# EAGLE design KS0108_MCP23x17 (EAGLE 7.6.0)
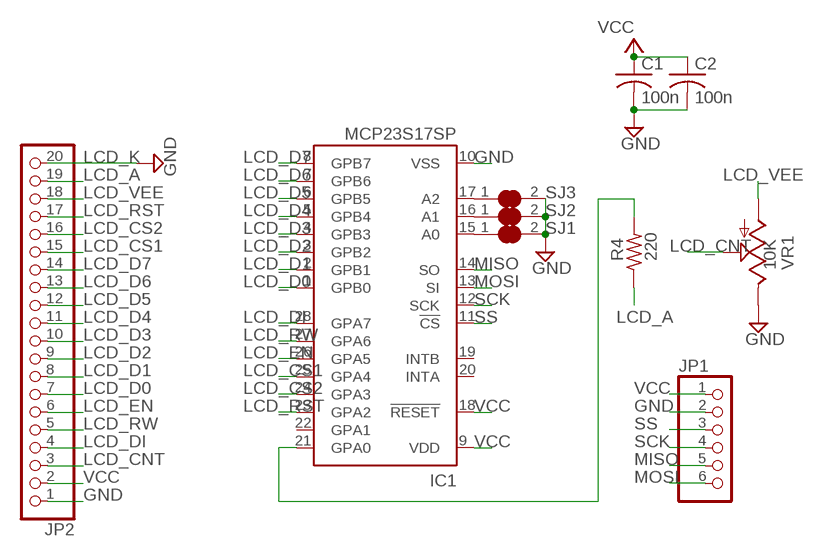
[diagram p0: schematic, sheet 1]

## Parts
C1  100n  C-USC0805K  [C0805K]
C2  100n  C-USC0805K  [C0805K]
IC1  MCP23S17SP  [DIL28-3]
JP1  PINHD-1X6CB  [1X06-CLEANBIG]
JP2  PINHD-1X20-BIG  [1X20-BIG]
R4  220  R-US_R0805  [R0805]
SJ1  SOLDERJUMPER_CLOSED  [SOLDERJUMPER_CLOSEDWIRE]
SJ2  SOLDERJUMPER_CLOSED  [SOLDERJUMPER_CLOSEDWIRE]
SJ3  SOLDERJUMPER_CLOSED  [SOLDERJUMPER_CLOSEDWIRE]
VR1  10K  TRIM_US-B25P  [B25P]

## Nets
GND: C1.2 C2.2 IC1.10(VSS) JP1.2 JP2.1 JP2.20 SJ1.2 SJ2.2 SJ3.2 VR1.E
LCD_A: JP2.19 R4.1
LCD_CNT: JP2.3 VR1.S
LCD_CS1: IC1.25(GPA4) JP2.15
LCD_CS2: IC1.24(GPA3) JP2.16
LCD_D0: IC1.1(GPB0) JP2.7
LCD_D1: IC1.2(GPB1) JP2.8
LCD_D2: IC1.3(GPB2) JP2.9
LCD_D3: IC1.4(GPB3) JP2.10
LCD_D4: IC1.5(GPB4) JP2.11
LCD_D5: IC1.6(GPB5) JP2.12
LCD_D6: IC1.7(GPB6) JP2.13
LCD_D7: IC1.8(GPB7) JP2.14
LCD_DI: IC1.28(GPA7) JP2.4
LCD_EN: IC1.26(GPA5) JP2.6
LCD_RST: IC1.23(GPA2) JP2.17
LCD_RW: IC1.27(GPA6) JP2.5
LCD_VEE: JP2.18 VR1.A
MISO: IC1.14(SO) JP1.5
MOSI: IC1.13(SI) JP1.6
N$1: IC1.21(GPA0) R4.2
N$2: IC1.15(A0) SJ1.1
N$3: IC1.16(A1) SJ2.1
N$4: IC1.17(A2) SJ3.1
SCK: IC1.12(SCK) JP1.4
SS: IC1.11(!CS) JP1.3
VCC: C1.1 C2.1 IC1.9(VDD) IC1.18(!RESET) JP1.1 JP2.2
Unconnected: IC1.19(INTB) IC1.20(INTA) IC1.22(GPA1)

## Notes on the sheet
- LCD_K

## Library data of the parts
C1 C2 = adafruit:C-US: CAPACITOR, American symbol
IC1 = microchip:MCP23S17: http://ww1.microchip.com/downloads/en/DeviceDoc/21952a.pdf Source: http://ww1.microchip.com/downloads/en/DeviceDoc/21952a.pdf; MF: MICROCHIP; MPN: MCP23S17-E/SP; OC_FARNELL: 1292238; OC_NEWARK: 31K2951
JP1 = adafruit:PINHD-1X6: PIN HEADER
JP2 = adafruit:PINHD-1X20: PIN HEADER
R4 = resistor:R-US_: RESISTOR, American symbol
SJ1-SJ3 = microbuilder:SOLDERJUMPER_CLOSED: Solder Jumper - Closed These solder jumpers are closed by default CLOSEDWIRE - 10 mil trace between pads that can be cut and resoldered later CLOSEDPERM - 63 mil trace between pads for a permanent connection (used to 'bridge' two signals, a shameless hack for Eagle). Can double as a test point as well (no cream layer)
VR1 = pot:TRIM_US-: POTENTIOMETER

## Net classes
0 default: width 0.203 mm, clearance 0.203 mm

## Board
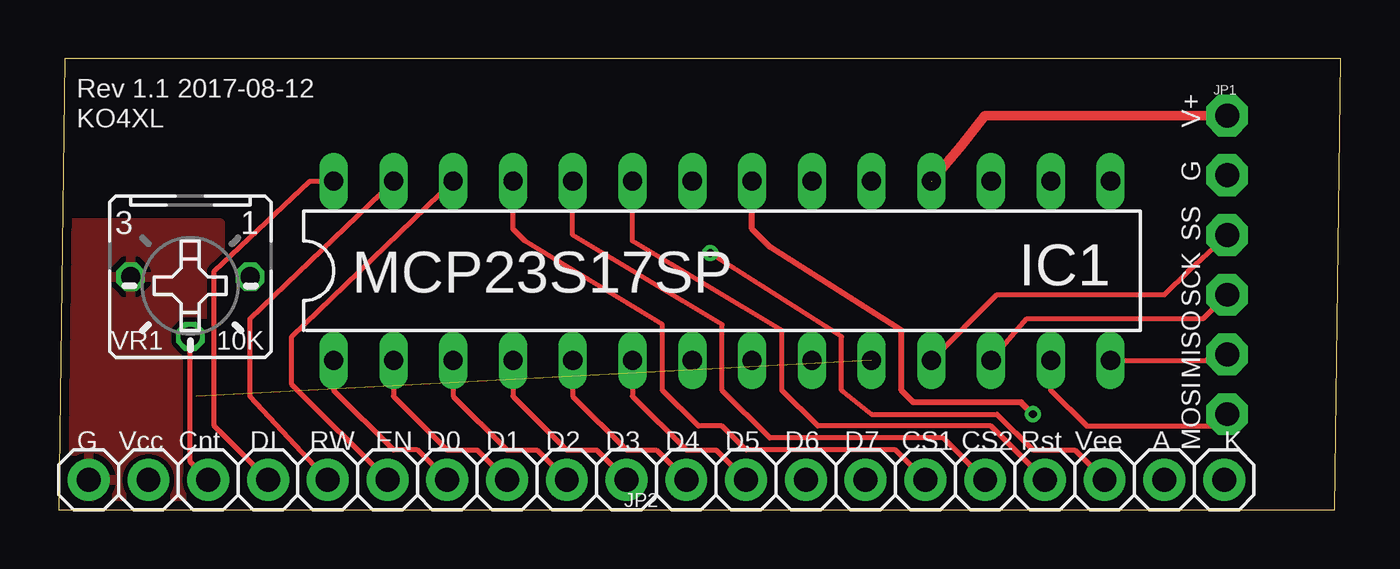
[diagram p1: board, top side]
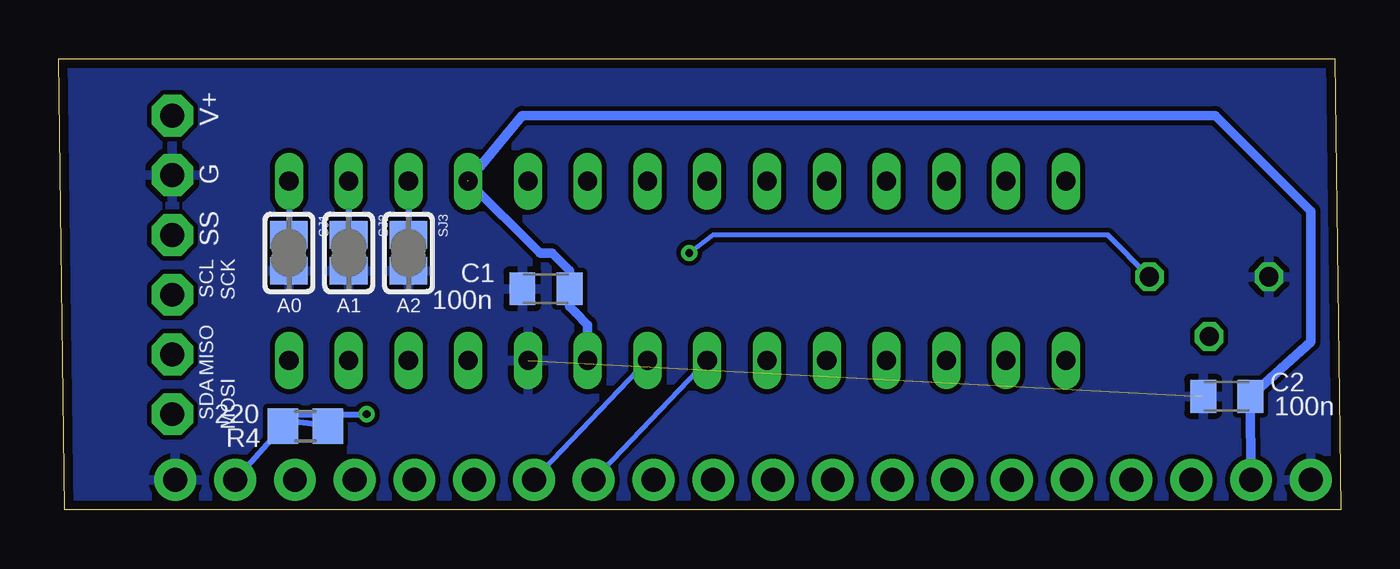
[diagram p2: board, bottom side, seen from below]

Size 54.48 x 19.18 mm. Coordinates in mm from the lower left corner, seen from the top.
Outline: 0,0 54.23,0 54.48,19.18 0.25,19.18 0,0
Copper layers (1*16): Top 0.0356mm / dielectric 1.5011mm / Bottom 0.0356mm
Design rules "OSHPark": minimum track width 6mil, minimum drill 13mil, track to track 6mil, track to pad 6mil, pad to pad 6mil, via to via 6mil, smd to smd 6mil, copper to edge 15mil, drill to drill 6mil, minimum pad ring 7mil, minimum via ring 7mil, stop-mask expansion 4mil, vias tented up to drill 0mil, thermal gap 10mil

### Footprints (pad centres in the part's own frame; a part is rotated, then mirrored left to right if it is on the bottom)
C0805K = smd 1.1 x 1.4: 1 -1,0; 2 1,0
DIL28-3 = drill 0.813 long: 1 -16.51,-3.81; 2 -13.97,-3.81; 3 -11.43,-3.81; 4 -8.89,-3.81; 5 -6.35,-3.81; 6 -3.81,-3.81; 7 -1.27,-3.81; 8 1.27,-3.81; 9 3.81,-3.81; 10 6.35,-3.81; 11 8.89,-3.81; 12 11.43,-3.81; 13 13.97,-3.81; 14 16.51,-3.81; 15 16.51,3.81; 16 13.97,3.81; 17 11.43,3.81; 18 8.89,3.81; 19 6.35,3.81; 20 3.81,3.81; 21 1.27,3.81; 22 -1.27,3.81; 23 -3.81,3.81; 24 -6.35,3.81; 25 -8.89,3.81; 26 -11.43,3.81; 27 -13.97,3.81; 28 -16.51,3.81
1X06-CLEANBIG = drill 1.016 pad 1.778 octagon: 1 -6.35,0; 2 -3.81,0; 3 -1.27,0; 4 1.27,0; 5 3.81,0; 6 6.35,0
1X20-BIG = drill 1.016 pad 1.778: 1 -24.13,0; 2 -21.59,0; 3 -19.05,0; 4 -16.51,0; 5 -13.97,0; 6 -11.43,0; 7 -8.89,0; 8 -6.35,0; 9 -3.81,0; 10 -1.27,0; 11 1.27,0; 12 3.81,0; 13 6.35,0; 14 8.89,0; 15 11.43,0; 16 13.97,0; 17 16.51,0; 18 19.05,0; 19 21.59,0; 20 24.13,0
R0805 = smd 1.3 x 1.5: 1 -0.95,0; 2 0.95,0
SOLDERJUMPER_CLOSEDWIRE = smd 1.168 x 1.6: 1 -0.762,0; 2 0.762,0 | smd 0.635 x 0.203: WIRE 0,0
B25P = drill 0.813 octagon: A -2.54,0; E 2.54,0; S 0,2.54

### Placement (x,y rotation side)
C1  33.78,9.4 180 bottom
C2  4.84,4.83 180 bottom
IC1  28.19,10.16 0 top
JP1  49.66,10.41 270 top
JP2  25.4,1.27 0 top
R4  44.01,3.56 0 bottom
SJ1  44.7,10.92 270 bottom
SJ2  42.16,10.92 270 bottom
SJ3  39.62,10.92 270 bottom
VR1  5.59,9.91 180 top

### Tracks (layer width: path | path; a pad name or v marks a point on that pad's centre or on a via)
GND  (1 unrouted)
  pour Bottom: 0,0 54.1,0 54.36,19.05 0.25,19.05
  pour Top: 6.86,0 0,0 0,12.19 6.86,12.19
LCD_A
  Bottom 0.254: JP2.19 R4.1
LCD_CNT
  Top 0.203: JP2.3 5.59,2.03 VR1.S
LCD_CS1
  Top 0.203: JP2.15 35.56,2.54 29.21,2.54 28.19,3.56 27.18,3.56 25.65,5.08 25.65,7.87 19.81,11.43 19.3,11.94 IC1.25
LCD_CS2
  Top 0.203: JP2.16 37.59,3.05 30.23,3.05 28.19,5.08 28.19,7.87 21.84,11.68 IC1.24
LCD_D0
  Top 0.203: JP2.7 15.24,2.54 14.22,2.54 11.68,5.08 IC1.1
LCD_D1
  Top 0.203: IC1.2 14.22,4.83 16.51,2.54 17.78,2.54 JP2.8
LCD_D2
  Top 0.203: IC1.3 16.76,4.83 19.05,2.54 20.32,2.54 JP2.9
LCD_D3
  Top 0.203: IC1.4 19.3,4.83 21.59,2.54 22.86,2.54 JP2.10
LCD_D4
  Top 0.203: IC1.5 21.84,4.83 24.13,2.54 25.4,2.54 JP2.11
LCD_D5
  Top 0.203: IC1.6 24.38,4.83 26.67,2.54 27.94,2.54 JP2.12
LCD_D6
  Bottom 0.203: IC1.7 JP2.13
LCD_D7
  Bottom 0.203: JP2.14 IC1.8
LCD_DI
  Top 0.203: JP2.4 6.6,3.56 6.6,10.16 10.67,13.97 IC1.28
LCD_EN
  Top 0.203: JP2.6 9.91,5.33 9.91,7.37 IC1.26
LCD_RST
  Top 0.203: JP2.17 39.62,3.56 32.26,3.56 30.73,5.08 30.73,7.62 24.38,11.43 IC1.23
LCD_RW
  Top 0.203: JP2.5 8.13,4.83 8.13,8.13 IC1.27
LCD_VEE  (via drill 0.33)
  Top 0.203: v27.69,10.92 33.27,7.37 33.27,5.08 34.54,4.06 39.88,4.06 41.4,2.54 43.18,2.54 JP2.18
  Bottom 0.203: VR1.A 9.91,11.68 26.67,11.68 v27.69,10.92
MISO
  Top 0.203: IC1.14 48.77,6.35 49.02,6.6 JP1.5
MOSI
  Top 0.203: IC1.13 42.16,5.08 43.69,3.56 49.02,3.56 49.53,4.06 JP1.6
N$1  (via drill 0.33)
  Top 0.254: v41.4,4.06 40.89,4.57 36.32,4.57 35.81,5.08 35.81,7.62 30.23,11.18 29.46,11.94 IC1.21
  Bottom 0.254: R4.2 44.96,3.81 44.7,4.06 v41.4,4.06
N$2
  Bottom 0.254: IC1.15 SJ1.1
N$3
  Bottom 0.254: IC1.16 SJ2.1
N$4
  Bottom 0.254: IC1.17 SJ3.1
SCK
  Top 0.203: IC1.12 41.15,8.13 48.64,8.13 JP1.4
SS
  Top 0.203: IC1.11 39.88,9.14 46.99,9.14 48.01,10.16 JP1.3
VCC  (1 unrouted)
  Top 0.406: JP1.1 39.37,16.76 38.35,15.49 IC1.18
  Bottom 0.406: IC1.18 34.8,16.76 5.33,16.76 1.27,12.7 1.27,7.15 C2.1 JP2.2 | IC1.9 32,7.86 32.51,8.38 32.78,8.65 C1.1 32.78,10.18 33.53,10.92 34.04,10.92 37.1,13.99

### Text on the board
tPlace: Rev 1.1 2017-08-12 | KO4XL | V+ | G | SS | SCK | MISO | G | Vcc | Cnt | DI | RW | EN | D0 | D1 | D2 | D3 | D4 | D5 | D6 | D7 | CS1 | CS2 | Rst | Vee | A | MOSI | K
bPlace: V+ | G | SS | SCL / SCK | A2 | A1 | A0 | MISO | SDA / MOSI